# Altium schematic sheet AMU-S14-V00-BSPDConnectivity.SchDoc: 8 Pin Connector
size A3; DrawnBy: Jonn Dillon; DocumentNumber: 10; Revision: 01; SheetNumber: 14; SheetTotal: 29
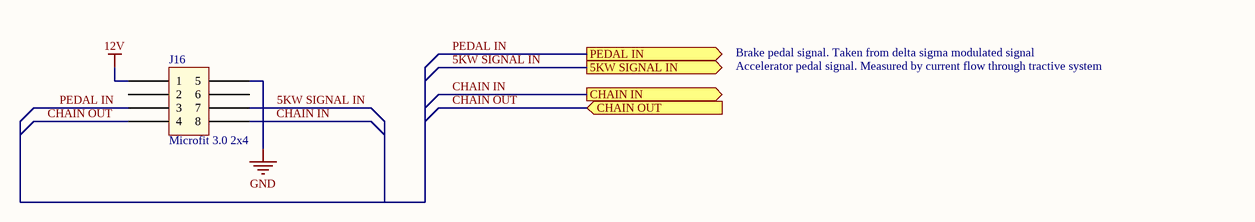
[diagram p0: AMU-S14-V00-BSPDConnectivity.SchDoc]

## Parts
J16  Microfit 3.0 2x4  [Microfit_2X4_R_TH]

## Ports
5KW SIGNAL IN (out), CHAIN IN (out), CHAIN OUT (in), PEDAL IN (out)

## Nets
12V: J16.1
GND: J16.5
5KW SIGNAL IN: J16.7 ; port 5KW SIGNAL IN
CHAIN IN: J16.8 ; port CHAIN IN
CHAIN OUT: J16.4 ; port CHAIN OUT
PEDAL IN: J16.3 ; port PEDAL IN

Not connected (* = marked no-connect by the designer): J16 2 6

## Notes on the sheet
- Brake pedal signal. Taken from delta sigma modulated signal
- Accelerator pedal signal. Measured by current flow through tractive system
- Revision History:
- Sheet Title:
- Rev
- Date
- Description
- Project:
- Size:
- Drawn By:
- A3
- Number:
- Revision:
- Sheet
- Version:
- of
- QUT Motorsport
- O-120, Gardens Point
- 2 George Street
- Brisbane, QLD 4000
- Australia
- Print Date:
- Print Time:
- File Name:

## Library data of the parts
J16 = Microfit_2x4